# EAGLE schematic Module_20200402_0_ServoAdapter (EAGLE 9.3.2)
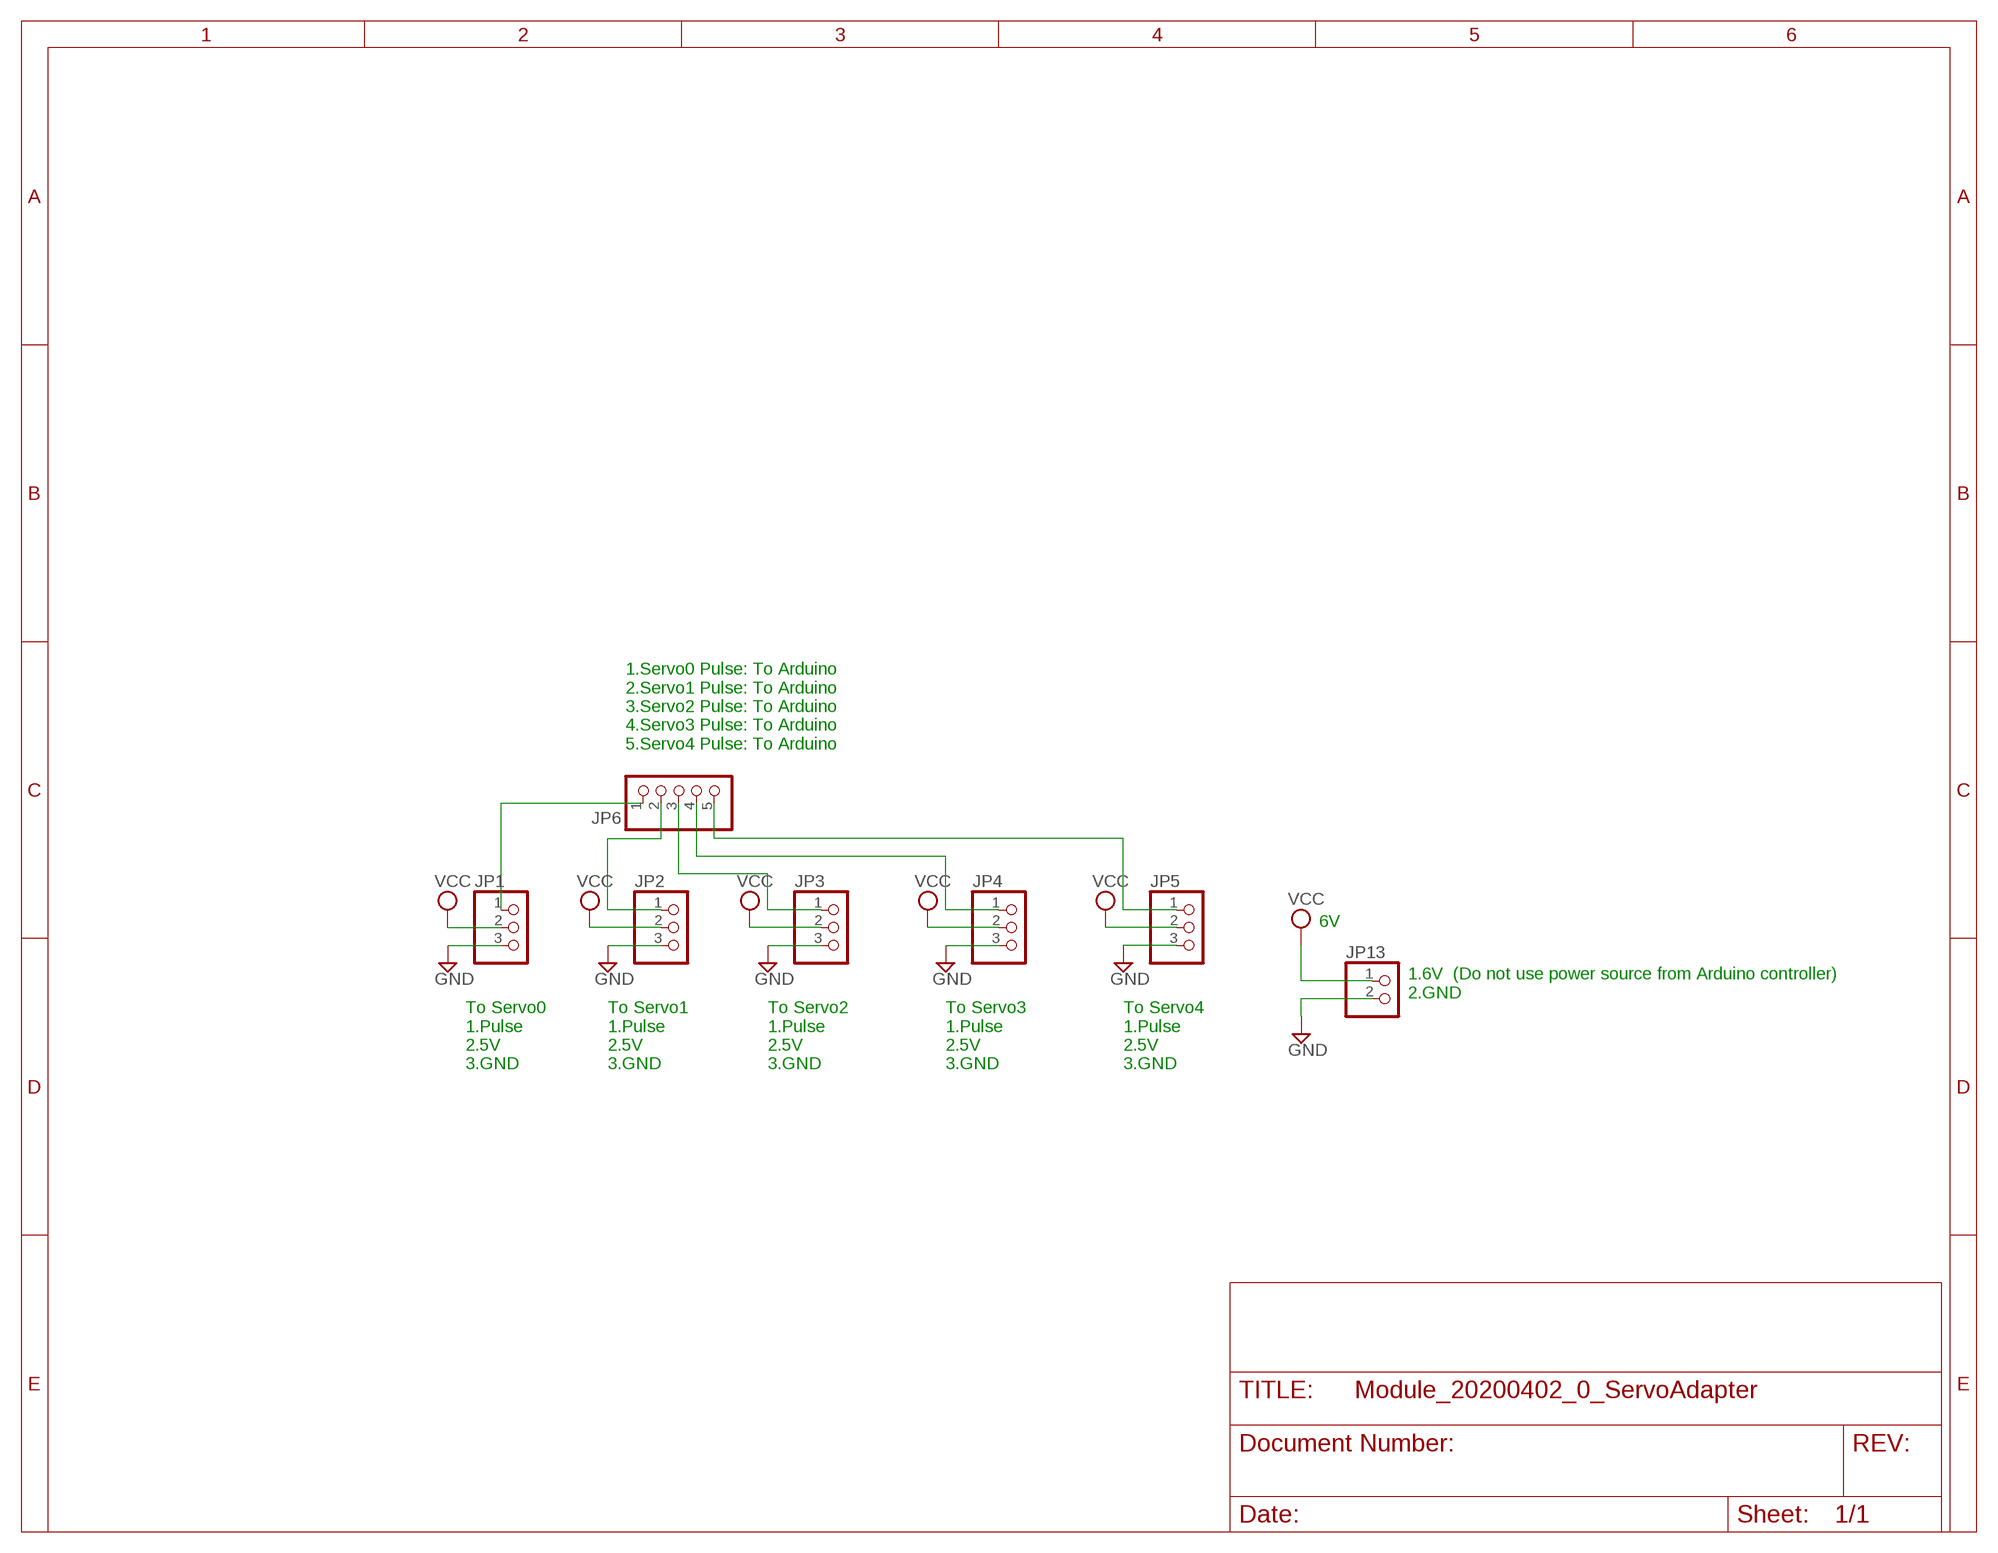
[diagram p0: schematic, sheet 1]

## Parts
JP1  PINHD-1X3  [1X03]
JP2  PINHD-1X3  [1X03]
JP3  PINHD-1X3  [1X03]
JP4  PINHD-1X3  [1X03]
JP5  PINHD-1X3  [1X03]
JP6  PINHD-1X5  [1X05]
JP13  PINHD-1X2  [1X02]

## Nets
GND: JP1.3 JP2.3 JP3.3 JP4.3 JP5.3 JP13.2
N$1: JP1.1 JP6.1
N$2: JP2.1 JP6.2
N$3: JP3.1 JP6.3
N$4: JP4.1 JP6.4
N$5: JP5.1 JP6.5
VCC: JP1.2 JP2.2 JP3.2 JP4.2 JP5.2 JP13.1

## Notes on the sheet
- 1.Servo0 Pulse: To Arduino
  2.Servo1 Pulse: To Arduino
  3.Servo2 Pulse: To Arduino
  4.Servo3 Pulse: To Arduino
  5.Servo4 Pulse: To Arduino
- 6V
- 1.6V  (Do not use power source from Arduino controller)
  2.GND
- To Servo0
  1.Pulse
  2.5V
  3.GND
- To Servo1
  1.Pulse
  2.5V
  3.GND
- To Servo2
  1.Pulse
  2.5V
  3.GND
- To Servo3
  1.Pulse
  2.5V
  3.GND
- To Servo4
  1.Pulse
  2.5V
  3.GND

## Library data of the parts
JP1-JP5 = pinhead:PINHD-1X3: PIN HEADER
JP6 = pinhead:PINHD-1X5: PIN HEADER
JP13 = pinhead:PINHD-1X2: PIN HEADER